# Altium schematic sheet MCU.SchDoc
size A4; SheetNumber: 1; SheetTotal: 5
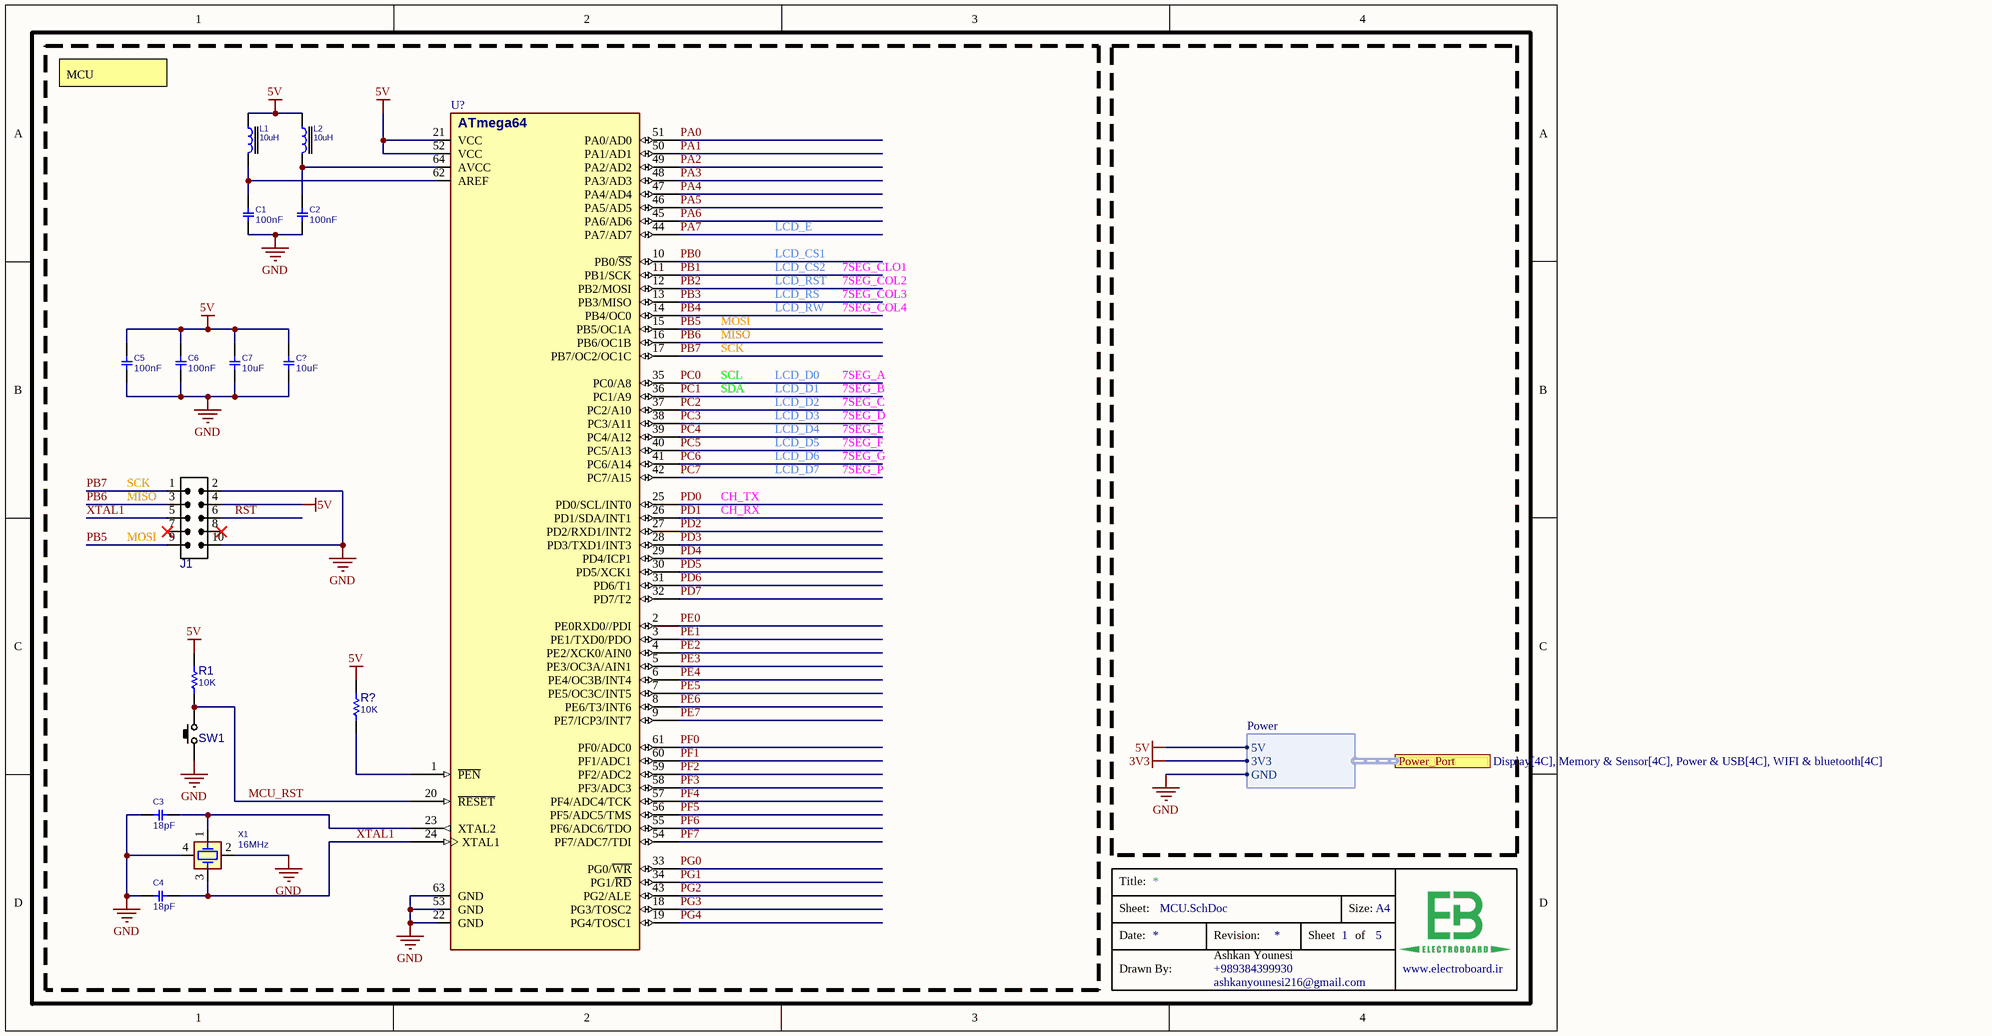
[diagram p0: MCU.SchDoc]

## Parts
C1  100nF  [C0805]
C2  100nF  [C0805]
C3  18pF  [C0805]
C4  18pF  [C0805]
C5  100nF  [C0805]
C6  100nF  [C0805]
C7  10uF  [C0805]
C?  10uF  [C0805]
J1  IDC_2X5  [IDC_2X5]  (value not drawn)
L1  10uH  [L0805]
L2  10uH  [L0805]
R1  10K  [R0805]
R?  10K  [R0805]
SW1  PUSHBUTTON  [SWPBS_SPST_6X3X5]  (value not drawn)
U?  ATMEGA64  [QFG80_64]  (value not drawn)
X1  16MHz  [XTL_4_3225]

## Ports
Power_Port (harness POWER, see Display[4C], Memory & Sensor[4C], Power & USB[4C], WIFI & bluetooth[4C])

## Harnesses
Power: 5V, 3V3, GND

## Nets
3V3: port Power_Port.3V3
5V: C5.2 C6.2 C7.2 C?.2 J1.4 L1.1 L2.1 R1.1 R?.1 U?.21(VCC) U?.52(VCC) ; port Power_Port.5V
GND: C1.1 C2.1 C3.2 C4.1 C5.1 C6.1 C7.1 C?.1 J1.2 J1.10 SW1.1(P1) U?.22(GND) U?.53(GND) U?.63(GND) X1.2 X1.4 ; port Power_Port.GND
MCU_RST: R1.2 SW1.2(P3) U?.20(~{RESET})
PA0: U?.51(PA0/AD0)
PA1: U?.50(PA1/AD1)
PA2: U?.49(PA2/AD2)
PA3: U?.48(PA3/AD3)
PA4: U?.47(PA4/AD4)
PA5: U?.46(PA5/AD5)
PA6: U?.45(PA6/AD6)
PA7: U?.44(PA7/AD7)
PB0: U?.10(PB0/~{SS})
PB1: U?.11(PB1/SCK)
PB2: U?.12(PB2/MOSI)
PB3: U?.13(PB3/MISO)
PB4: U?.14(PB4/OC0)
PB5: J1.9 U?.15(PB5/OC1A)
PB6: J1.3 U?.16(PB6/OC1B)
PB7: J1.1 U?.17(PB7/OC2/OC1C)
PC0: U?.35(PC0/A8)
PC1: U?.36(PC1/A9)
PC2: U?.37(PC2/A10)
PC3: U?.38(PC3/A11)
PC4: U?.39(PC4/A12)
PC5: U?.40(PC5/A13)
PC6: U?.41(PC6/A14)
PC7: U?.42(PC7/A15)
PD0: U?.25(PD0/SCL/INT0)
PD1: U?.26(PD1/SDA/INT1)
PD2: U?.27(PD2/RXD1/INT2)
PD3: U?.28(PD3/TXD1/INT3)
PD4: U?.29(PD4/ICP1)
PD5: U?.30(PD5/XCK1)
PD6: U?.31(PD6/T1)
PD7: U?.32(PD7/T2)
PE0: U?.2(PE0RXD0//PDI)
PE1: U?.3(PE1/TXD0/PDO)
PE2: U?.4(PE2/XCK0/AIN0)
PE3: U?.5(PE3/OC3A/AIN1)
PE4: U?.6(PE4/OC3B/INT4)
PE5: U?.7(PE5/OC3C/INT5)
PE6: U?.8(PE6/T3/INT6)
PE7: U?.9(PE7/ICP3/INT7)
PF0: U?.61(PF0/ADC0)
PF1: U?.60(PF1/ADC1)
PF2: U?.59(PF2/ADC2)
PF3: U?.58(PF3/ADC3)
PF4: U?.57(PF4/ADC4/TCK)
PF5: U?.56(PF5/ADC5/TMS)
PF6: U?.55(PF6/ADC6/TDO)
PF7: U?.54(PF7/ADC7/TDI)
PG0: U?.33(PG0/~{WR})
PG1: U?.34(PG1/~{RD})
PG2: U?.43(PG2/ALE)
PG3: U?.18(PG3/TOSC2)
PG4: U?.19(PG4/TOSC1)
RST: J1.6
XTAL1: C4.2 J1.5 U?.24(XTAL1) X1.3
NetC1_2: C1.2 L1.2 U?.62(AREF)
NetC2_2: C2.2 L2.2 U?.64(AVCC)
NetC3_1: C3.1 U?.23(XTAL2) X1.1
NetR?_2: R?.2 U?.1(~{PEN})

Not connected (* = marked no-connect by the designer): J1 7* 8*

## Notes on the sheet
- MCU
- LCD_E
- LCD_RW
- LCD_RS
- LCD_RST
- LCD_CS2
- LCD_CS1
- 7SEG_CLO1
- 7SEG_COL2
- 7SEG_COL3
- 7SEG_COL4
- SCK
- MISO
- MOSI
- SCL
- LCD_D0
- 7SEG_A
- SDA
- LCD_D5
- LCD_D4
- LCD_D3
- LCD_D2
- LCD_D1
- 7SEG_B
- 7SEG_C
- 7SEG_D
- 7SEG_E
- 7SEG_F
- (near J1) SCK
- (near J1) MISO
- CH_TX
- CH_RX
- LCD_D7
- LCD_D6
- 7SEG_G
- 7SEG_P
- (near J1) MOSI
- Title:
- Sheet:
- Size:
- A4
- Drawn By:
- Date:
- Revision:
- Ashkan Younesi
- ashkanyounesi216@gmail.com
- +989384399930
- Sheet
- of
- www.electroboard.ir <http://www.electroboard.ir>
- (in symbol ATMEGA64A_QFP64) ATmega64

## Library data of the parts
C1-C7 C? = CAP_SMD_MLCC_0805: CAP, MLCC; PARAM: -, -%; MANF_P#: MANF_PART#; PARAM2: -V; PRICE: 100= 1$; MANF: -; ASSEMBLY: ASSEMBLY
  C1 C2 C5 C6: VALUE: 100nF
  C3 C4: VALUE: 18pF
  C7 C?: VALUE: 10uF
J1 = IDC_2X5: CONN, IDC, Male, pitch: 2.54mm, 10POS; VALUE: IDC_2X5
L1 L2 = IND_SMD_470nH_3.2A: INDUCTOR, 470nH, 3.2A (Irms), 36mOhm; PARAM: 3.2A (Irms), -55~155oC; MANF: Taiyo Yuden; PARAM2: 36mOhm, 0.8mm Height; MANF_P#: MCHK2012TR47M; PRICE: 0.25$; ASSEMBLY: ASSEMBLY; VALUE: 10uH
R1 R? = RES_SMD_0805: RESISTOR, SMD; PARAM: -W; DESC: DESCRIPTION; DIST#: MOUSER; PARAM2: 1%; MANF_P#: -; MANF: -; ASSEMBLY: ASSEMBLY; PRICE: 100= 0.5$; VALUE: 10K
SW1 = SWPBS_SPST_6X3X5: SWITCH, PUSH BUTTON, TACTILE, SMD, SPST, 6X3.5X5mm; MANF: ALPS; DESC: DESCRIPTION; MANF_P#: SKQMBBE010; VALUE: PUSHBUTTON; ASSEMBLY: ASSEMBLY; PARAM: PARAM; PRICE: PRICE
U? = ATMEGA64A_QFP64: MCU, AVR, 8-Bit, 64KB, 4KB RAM, 16MHz; MANF_P#: ATMEGA64A-AU; DESC: 2KB EEPROM; MANF: ATMEL/MICROCHIP; PARAM2: 2.7~5.5V; PARAM: 64KB, 4KB RAM, 16MHz, -40~85°C; PRICE: 4.5$; VALUE: ATMEGA64
X1 = XTL_4_12MHz_3225: Crystal 12MHz; MANF: ECS; MANF_P#: ECS-120-18-33-JEM-TR; PARAM: 20PPM, 18pF; PRICE: 0.5$; VALUE: 16MHz